# Altium project LiIonCharger.PrjPcb
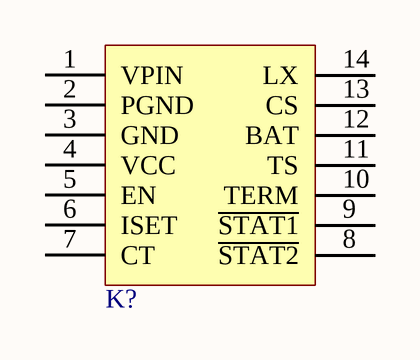
[diagram p0: ChargerSchema.SchDoc]
1 sheet, 1 parts. Net scope: global (net labels, ports and power ports of the same name join across sheets).
Board file: ChargerPCB.PcbDoc

## Sheet ChargerSchema.SchDoc
size A4; SheetNumber: 1; SheetTotal: 1

### Parts
K?  AAT3620IWO  [14-TDFN Skyworks]  (value not drawn)

### Nets

Not connected (* = marked no-connect by the designer): K? 1(VPIN) 2(PGND) 3(GND) 4(VCC) 5(EN) 6(ISET) 7(CT) 8(~{STAT2}) 9(~{STAT1}) 10(TERM) 11(TS) 12(BAT) 13(CS) 14(LX)

### Library data of the parts
K? = Charger IC Li-Ion: 2A Li-Ion 1Cell charger / 5V In